# Altium schematic sheet Public DDR.schdoc
size 452 x 351 mm
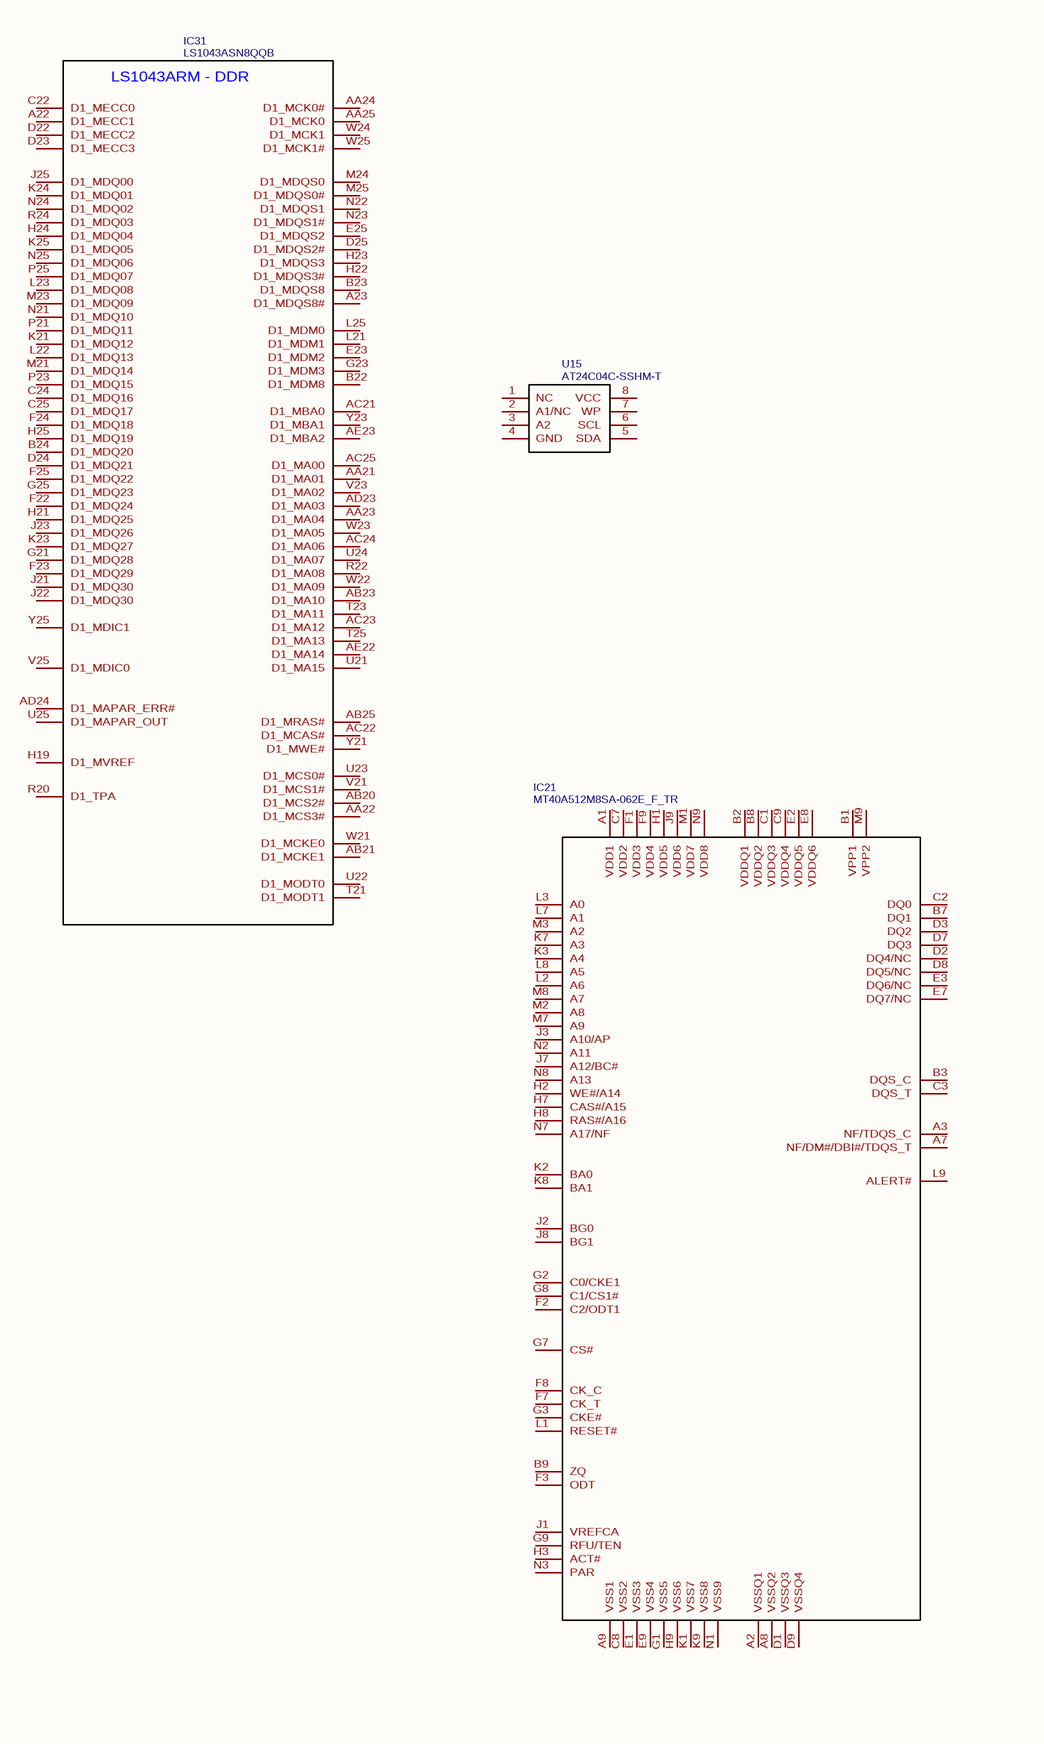
[diagram p0: Public DDR.schdoc, left]
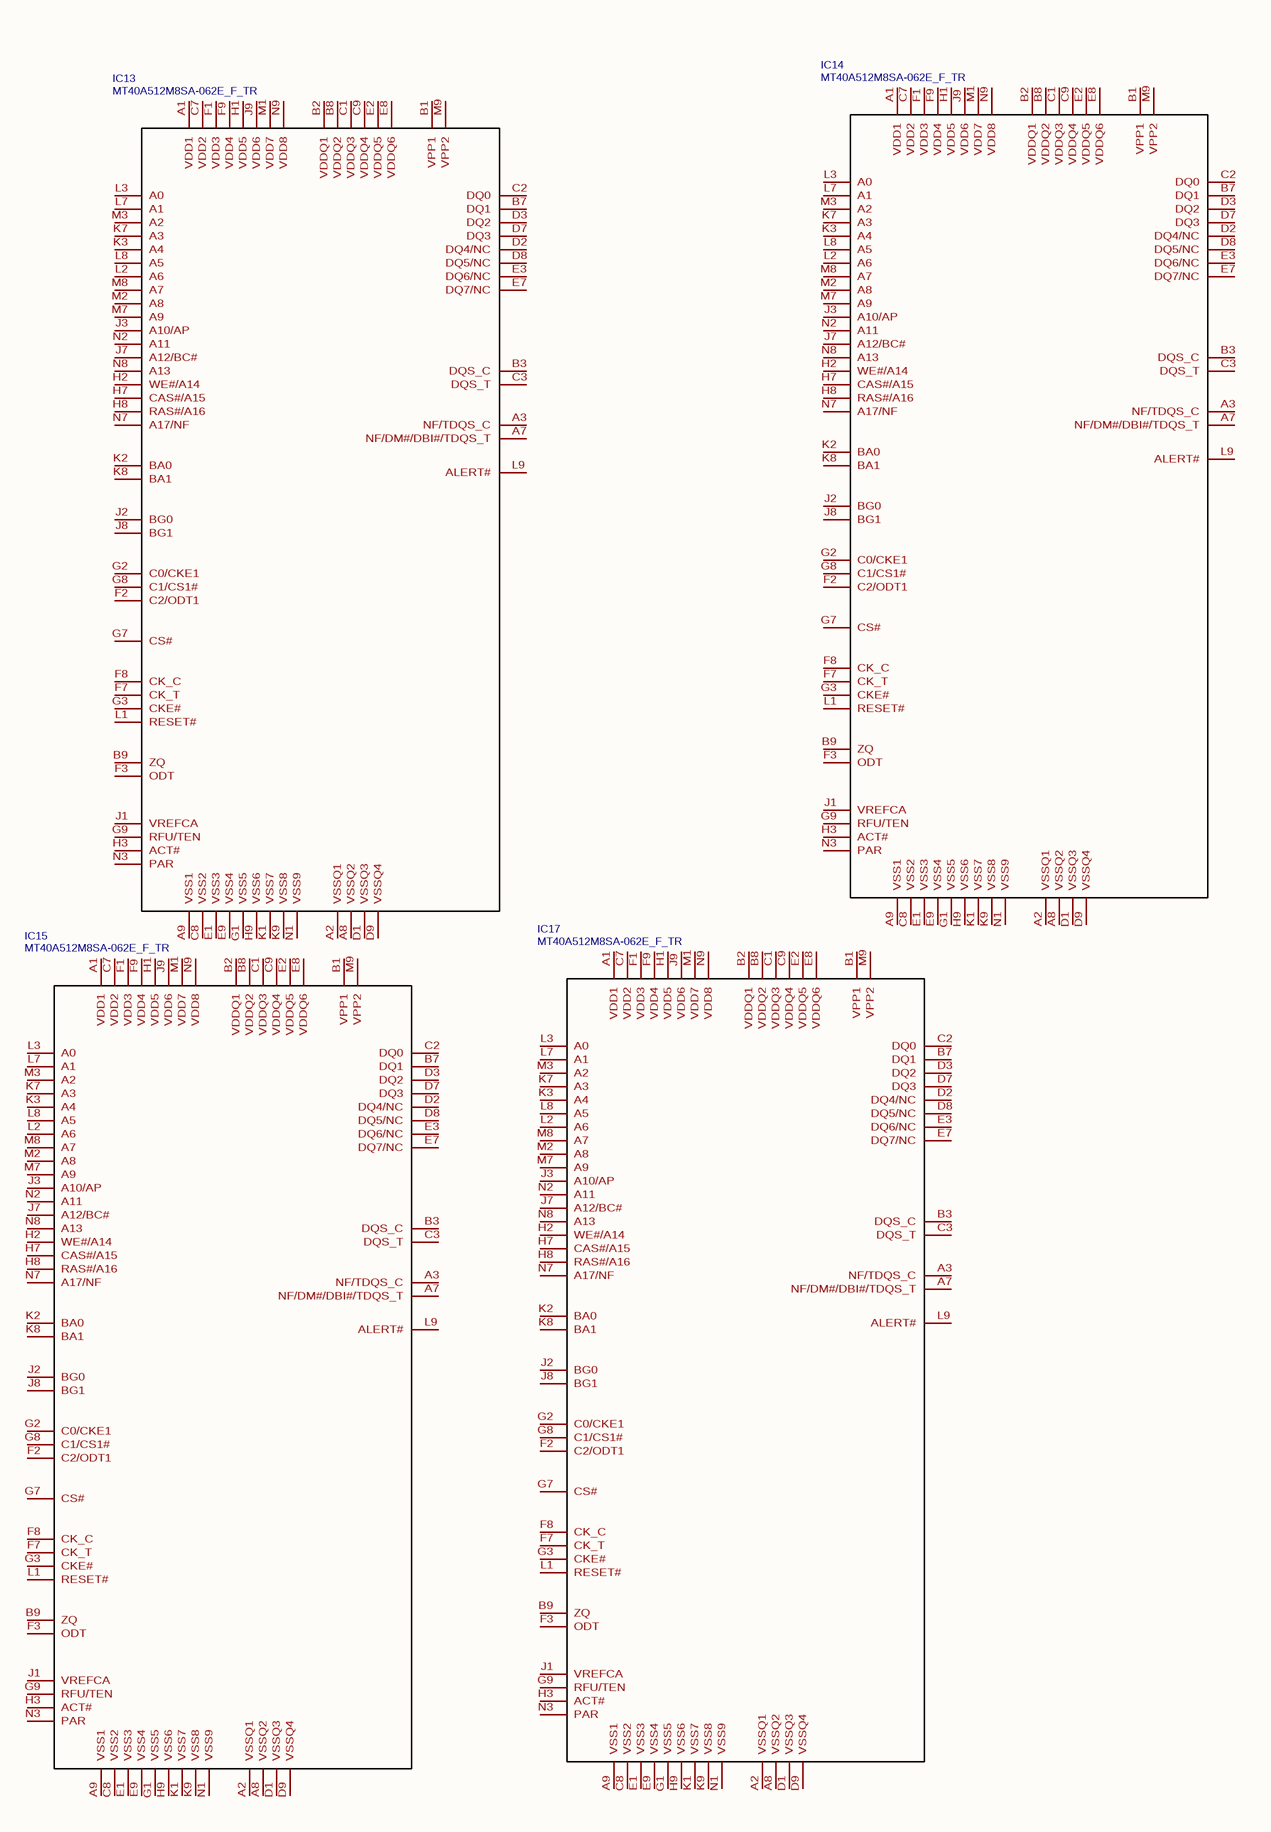
[diagram p1: Public DDR.schdoc, right]

## Parts
IC13  MT40A512M8SA-062E_F_TR  [BGA78C80P9X13_750X1100X120]
IC14  MT40A512M8SA-062E_F_TR  [BGA78C80P9X13_750X1100X120]
IC15  MT40A512M8SA-062E_F_TR  [BGA78C80P9X13_750X1100X120]
IC17  MT40A512M8SA-062E_F_TR  [BGA78C80P9X13_750X1100X120]
IC21  MT40A512M8SA-062E_F_TR  [BGA78C80P9X13_750X1100X120]
IC31  LS1043ASN8QQB  [BGA621C65P25X25_1700X1700X218N]
U15  AT24C04C-SSHM-T  [SOIC-8_L5.0-W4.0-P1.27-LS6.0-BL]

## Nets

Not connected (* = marked no-connect by the designer): IC13 A1(VDD1) A2(VSSQ1) A3(NF/TDQS_C) A7(NF/DM#/DBI#/TDQS_T) A8(VSSQ2) A9(VSS1) B1(VPP1) B2(VDDQ1) B3(DQS_C) B7(DQ1) B8(VDDQ2) B9(ZQ) C1(VDDQ3) C2(DQ0) C3(DQS_T) C7(VDD2) C8(VSS2) C9(VDDQ4) D1(VSSQ3) D2(DQ4/NC) D3(DQ2) D7(DQ3) D8(DQ5/NC) D9(VSSQ4) E1(VSS3) E2(VDDQ5) E3(DQ6/NC) E7(DQ7/NC) E8(VDDQ6) E9(VSS4) F1(VDD3) F2(C2/ODT1) F3(ODT) F7(CK_T) F8(CK_C) F9(VDD4) G1(VSS5) G2(C0/CKE1) G3(CKE#) G7(CS#) G8(C1/CS1#) G9(RFU/TEN) H1(VDD5) H2(WE#/A14) H3(ACT#) H7(CAS#/A15) H8(RAS#/A16) H9(VSS6) J1(VREFCA) J2(BG0) J3(A10/AP) J7(A12/BC#) J8(BG1) J9(VDD6) K1(VSS7) K2(BA0) K3(A4) K7(A3) K8(BA1) K9(VSS8) L1(RESET#) L2(A6) L3(A0) L7(A1) L8(A5) L9(ALERT#) M1(VDD7) M2(A8) M3(A2) M7(A9) M8(A7) M9(VPP2) N1(VSS9) N2(A11) N3(PAR) N7(A17/NF) N8(A13) N9(VDD8); IC14 A1(VDD1) A2(VSSQ1) A3(NF/TDQS_C) A7(NF/DM#/DBI#/TDQS_T) A8(VSSQ2) A9(VSS1) B1(VPP1) B2(VDDQ1) B3(DQS_C) B7(DQ1) B8(VDDQ2) B9(ZQ) C1(VDDQ3) C2(DQ0) C3(DQS_T) C7(VDD2) C8(VSS2) C9(VDDQ4) D1(VSSQ3) D2(DQ4/NC) D3(DQ2) D7(DQ3) D8(DQ5/NC) D9(VSSQ4) E1(VSS3) E2(VDDQ5) E3(DQ6/NC) E7(DQ7/NC) E8(VDDQ6) E9(VSS4) F1(VDD3) F2(C2/ODT1) F3(ODT) F7(CK_T) F8(CK_C) F9(VDD4) G1(VSS5) G2(C0/CKE1) G3(CKE#) G7(CS#) G8(C1/CS1#) G9(RFU/TEN) H1(VDD5) H2(WE#/A14) H3(ACT#) H7(CAS#/A15) H8(RAS#/A16) H9(VSS6) J1(VREFCA) J2(BG0) J3(A10/AP) J7(A12/BC#) J8(BG1) J9(VDD6) K1(VSS7) K2(BA0) K3(A4) K7(A3) K8(BA1) K9(VSS8) L1(RESET#) L2(A6) L3(A0) L7(A1) L8(A5) L9(ALERT#) M1(VDD7) M2(A8) M3(A2) M7(A9) M8(A7) M9(VPP2) N1(VSS9) N2(A11) N3(PAR) N7(A17/NF) N8(A13) N9(VDD8); IC15 A1(VDD1) A2(VSSQ1) A3(NF/TDQS_C) A7(NF/DM#/DBI#/TDQS_T) A8(VSSQ2) A9(VSS1) B1(VPP1) B2(VDDQ1) B3(DQS_C) B7(DQ1) B8(VDDQ2) B9(ZQ) C1(VDDQ3) C2(DQ0) C3(DQS_T) C7(VDD2) C8(VSS2) C9(VDDQ4) D1(VSSQ3) D2(DQ4/NC) D3(DQ2) D7(DQ3) D8(DQ5/NC) D9(VSSQ4) E1(VSS3) E2(VDDQ5) E3(DQ6/NC) E7(DQ7/NC) E8(VDDQ6) E9(VSS4) F1(VDD3) F2(C2/ODT1) F3(ODT) F7(CK_T) F8(CK_C) F9(VDD4) G1(VSS5) G2(C0/CKE1) G3(CKE#) G7(CS#) G8(C1/CS1#) G9(RFU/TEN) H1(VDD5) H2(WE#/A14) H3(ACT#) H7(CAS#/A15) H8(RAS#/A16) H9(VSS6) J1(VREFCA) J2(BG0) J3(A10/AP) J7(A12/BC#) J8(BG1) J9(VDD6) K1(VSS7) K2(BA0) K3(A4) K7(A3) K8(BA1) K9(VSS8) L1(RESET#) L2(A6) L3(A0) L7(A1) L8(A5) L9(ALERT#) M1(VDD7) M2(A8) M3(A2) M7(A9) M8(A7) M9(VPP2) N1(VSS9) N2(A11) N3(PAR) N7(A17/NF) N8(A13) N9(VDD8); IC17 A1(VDD1) A2(VSSQ1) A3(NF/TDQS_C) A7(NF/DM#/DBI#/TDQS_T) A8(VSSQ2) A9(VSS1) B1(VPP1) B2(VDDQ1) B3(DQS_C) B7(DQ1) B8(VDDQ2) B9(ZQ) C1(VDDQ3) C2(DQ0) C3(DQS_T) C7(VDD2) C8(VSS2) C9(VDDQ4) D1(VSSQ3) D2(DQ4/NC) D3(DQ2) D7(DQ3) D8(DQ5/NC) D9(VSSQ4) E1(VSS3) E2(VDDQ5) E3(DQ6/NC) E7(DQ7/NC) E8(VDDQ6) E9(VSS4) F1(VDD3) F2(C2/ODT1) F3(ODT) F7(CK_T) F8(CK_C) F9(VDD4) G1(VSS5) G2(C0/CKE1) G3(CKE#) G7(CS#) G8(C1/CS1#) G9(RFU/TEN) H1(VDD5) H2(WE#/A14) H3(ACT#) H7(CAS#/A15) H8(RAS#/A16) H9(VSS6) J1(VREFCA) J2(BG0) J3(A10/AP) J7(A12/BC#) J8(BG1) J9(VDD6) K1(VSS7) K2(BA0) K3(A4) K7(A3) K8(BA1) K9(VSS8) L1(RESET#) L2(A6) L3(A0) L7(A1) L8(A5) L9(ALERT#) M1(VDD7) M2(A8) M3(A2) M7(A9) M8(A7) M9(VPP2) N1(VSS9) N2(A11) N3(PAR) N7(A17/NF) N8(A13) N9(VDD8); IC21 A1(VDD1) A2(VSSQ1) A3(NF/TDQS_C) A7(NF/DM#/DBI#/TDQS_T) A8(VSSQ2) A9(VSS1) B1(VPP1) B2(VDDQ1) B3(DQS_C) B7(DQ1) B8(VDDQ2) B9(ZQ) C1(VDDQ3) C2(DQ0) C3(DQS_T) C7(VDD2) C8(VSS2) C9(VDDQ4) D1(VSSQ3) D2(DQ4/NC) D3(DQ2) D7(DQ3) D8(DQ5/NC) D9(VSSQ4) E1(VSS3) E2(VDDQ5) E3(DQ6/NC) E7(DQ7/NC) E8(VDDQ6) E9(VSS4) F1(VDD3) F2(C2/ODT1) F3(ODT) F7(CK_T) F8(CK_C) F9(VDD4) G1(VSS5) G2(C0/CKE1) G3(CKE#) G7(CS#) G8(C1/CS1#) G9(RFU/TEN) H1(VDD5) H2(WE#/A14) H3(ACT#) H7(CAS#/A15) H8(RAS#/A16) H9(VSS6) J1(VREFCA) J2(BG0) J3(A10/AP) J7(A12/BC#) J8(BG1) J9(VDD6) K1(VSS7) K2(BA0) K3(A4) K7(A3) K8(BA1) K9(VSS8) L1(RESET#) L2(A6) L3(A0) L7(A1) L8(A5) L9(ALERT#) M1(VDD7) M2(A8) M3(A2) M7(A9) M8(A7) M9(VPP2) N1(VSS9) N2(A11) N3(PAR) N7(A17/NF) N8(A13) N9(VDD8); IC31 A22(D1_MECC1) A23(D1_MDQS8#) AA21(D1_MA01) AA22(D1_MCS3#) AA23(D1_MA04) AA24(D1_MCK0#) AA25(D1_MCK0) AB20(D1_MCS2#) AB21(D1_MCKE1) AB23(D1_MA10) AB25(D1_MRAS#) AC21(D1_MBA0) AC22(D1_MCAS#) AC23(D1_MA12) AC24(D1_MA06) AC25(D1_MA00) AD23(D1_MA03) AD24(D1_MAPAR_ERR#) AE22(D1_MA14) AE23(D1_MBA2) B22(D1_MDM8) B23(D1_MDQS8) B24(D1_MDQ20) C22(D1_MECC0) C24(D1_MDQ16) C25(D1_MDQ17) D22(D1_MECC2) D23(D1_MECC3) D24(D1_MDQ21) D25(D1_MDQS2#) E23(D1_MDM2) E25(D1_MDQS2) F22(D1_MDQ24) F23(D1_MDQ29) F24(D1_MDQ18) F25(D1_MDQ22) G21(D1_MDQ28) G23(D1_MDM3) G25(D1_MDQ23) H19(D1_MVREF) H21(D1_MDQ25) H22(D1_MDQS3#) H23(D1_MDQS3) H24(D1_MDQ04) H25(D1_MDQ19) J21(D1_MDQ30) J22(D1_MDQ30) J23(D1_MDQ26) J25(D1_MDQ00) K21(D1_MDQ12) K23(D1_MDQ27) K24(D1_MDQ01) K25(D1_MDQ05) L21(D1_MDM1) L22(D1_MDQ13) L23(D1_MDQ08) L25(D1_MDM0) M21(D1_MDQ14) M23(D1_MDQ09) M24(D1_MDQS0) M25(D1_MDQS0#) N21(D1_MDQ10) N22(D1_MDQS1) N23(D1_MDQS1#) N24(D1_MDQ02) N25(D1_MDQ06) P21(D1_MDQ11) P23(D1_MDQ15) P25(D1_MDQ07) R20(D1_TPA) R22(D1_MA08) R24(D1_MDQ03) T21(D1_MODT1) T23(D1_MA11) T25(D1_MA13) U21(D1_MA15) U22(D1_MODT0) U23(D1_MCS0#) U24(D1_MA07) U25(D1_MAPAR_OUT) V21(D1_MCS1#) V23(D1_MA02) V25(D1_MDIC0) W21(D1_MCKE0) W22(D1_MA09) W23(D1_MA05) W24(D1_MCK1) W25(D1_MCK1#) Y21(D1_MWE#) Y23(D1_MBA1) Y25(D1_MDIC1); U15 1(NC) 2(A1/NC) 3(A2) 4(GND) 5(SDA) 6(SCL) 7(WP) 8(VCC)

## Notes on the sheet
- (in symbol LS1043ASN8QQB) LS1043ARM - DDR

## Library data of the parts
IC13-IC15 IC17 IC21 = MT40A512M8SA-062E_F_TR: Contributor: Ke'Ondrae_Mell; spicePre: I; spiceSymbolName: MT40A512M8SA-062E_F_TR
IC31 = LS1043ASN8QQB: subpart_no: 1; Contributor: Ke'Ondrae_Mell; spicePre: I; spiceSymbolName: LS1043ASN8QQB
U15 = AT24C04C-SSHM-T: BOM_Manufacturer: MICROCHIP; SMT Type: Extend; BOM_Supplier: LCSC; BOM_Manufacturer Part: AT24C04C-SSHM-T; image: //image.lceda.cn/szlcsc/C6205.jpg; BOM_Supplier Part: C6205; BOM_LCSC Assembly: Yes; spicePre: U; spiceSymbolName: AT24C04C-SSHM-T